# EAGLE schematic smartcar_shield_cutouts (EAGLE 9.4.0)
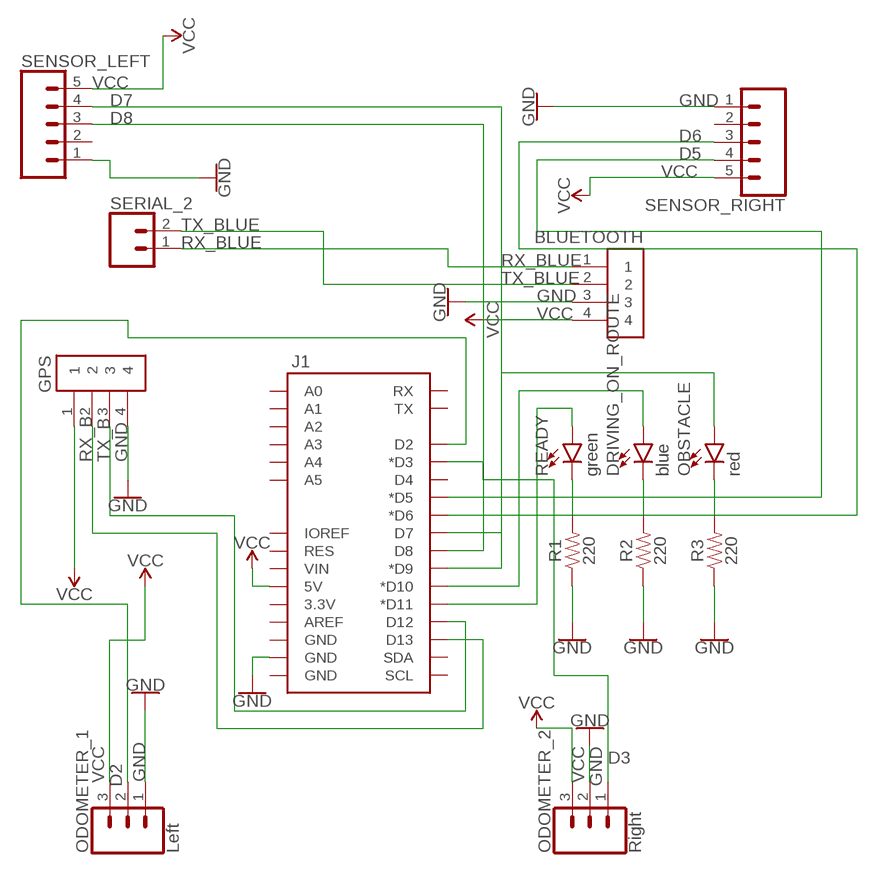
[diagram p0: schematic, sheet 1]

## Parts
BLUETOOTH  1X4-BIG  [1X04-BIG]
DRIVING_ON_ROUTE  blue  LED5MM  [LED_5MM]
GPS  1X4-BIG  [1X04-BIG]
J1  ARDUINO_R3_SHIELDUNO_R3_SHIELD_LOCK  [UNO_R3_SHIELD_LOCK]
OBSTACLE  red  LED5MM  [LED_5MM]
ODOMETER_1  Left  CONN_03  [1X03]
ODOMETER_2  Right  CONN_03  [1X03]
R1  220  220OHM-0603-1/10W-1%  [0603]
R2  220  220OHM-0603-1/10W-1%  [0603]
R3  220  220OHM-0603-1/10W-1%  [0603]
READY  green  LED5MM  [LED_5MM]
SENSOR_LEFT  CONN_05  [1X05]
SENSOR_RIGHT  CONN_05  [1X05]
SERIAL_2  CONN_02  [1X02]

## Nets
D2: J1.D2 ODOMETER_1.2
D3: J1.D3(*D3) ODOMETER_2.1
D5: J1.D5(*D5) SENSOR_RIGHT.4
D6: J1.D6(*D6) SENSOR_RIGHT.3
D7: J1.D7 SENSOR_LEFT.4
D8: J1.D8 SENSOR_LEFT.3
GND: BLUETOOTH.3 GPS.4 J1.GND@1(GND) ODOMETER_1.1 ODOMETER_2.2 R1.1 R2.1 R3.1 SENSOR_LEFT.1 SENSOR_RIGHT.1
N$2: R1.2 READY.K(C)
N$9: DRIVING_ON_ROUTE.K(C) R2.2
N$11: OBSTACLE.K(C) R3.2
N$12: J1.D11(*D11) READY.A
N$13: DRIVING_ON_ROUTE.A J1.D10(*D10)
N$14: J1.D9(*D9) OBSTACLE.A
RX_B: GPS.2 J1.D13
RX_BLUE: BLUETOOTH.1 SERIAL_2.1
TX_B: GPS.3 J1.D12
TX_BLUE: BLUETOOTH.2 SERIAL_2.2
VCC: BLUETOOTH.4 GPS.1 J1.5V ODOMETER_1.3 ODOMETER_2.3 SENSOR_LEFT.5 SENSOR_RIGHT.5
Unconnected: J1.3.3V J1.A0 J1.A1 J1.A2 J1.A3 J1.A4 J1.A5 J1.AREF J1.D4 J1.GND@0(GND) J1.GND@2(GND) J1.IOREF J1.RES J1.RX J1.SCL J1.SDA J1.TX J1.VIN SENSOR_LEFT.2 SENSOR_RIGHT.2

## Library data of the parts
BLUETOOTH GPS = adafruit:1X4: 4-pin connector
DRIVING_ON_ROUTE OBSTACLE READY = SparkFun-LED:LED: LED (Generic) Standard schematic elements and footprints for 5mm, 3mm, 1206, and 0603 sized LEDs. Generic LEDs with no color specified.
J1 = SparkFun-Boards:ARDUINO_R3_SHIELD: Shield form compatible with the Arduino Uno R3.
ODOMETER_1 ODOMETER_2 = SparkFun-Connectors:CONN_03: Multi connection point. Often used as Generic Header-pin footprint for 0.1 inch spaced/style header connections On any of the 0.1 inch spaced packages, you can populate with these: Break Away Headers - Straight <https://www.sparkfun.com/products/116> (PRT-00116) Break Away Male Headers - Right Angle <https://www.sparkfun.com/products/553> (PRT-00553) Female Headers <https://www.sparkfun.com/products/115> (PRT-00115) Break Away Headers - Machine Pin <https://www.sparkfun.com/products/117> (PRT-00117) Break Away Female Headers - Swiss Machine Pin <https://www.sparkfun.com/products/743> (PRT-00743) Stackable Header - 3 Pin (Female, 0.1") <https://www.sparkfun.com/products/13875> (PRT-13875) For SCREWTERMINALS and SPRING TERMINALS visit here: Screw Terimnals on SparkFun.com <https://www.sparkfun.com/search/results?term=Screw+Terminals> (5mm/3.5mm/2.54mm spacing) This device is also useful as a general connection point to wire up your design to another part of your project. Our various solder wires solder well into these plated through hole pads. Hook-Up Wire - Assortment (Stranded, 22 AWG) <https://www.sparkfun.com/products/11375> (PRT-11375) Hook-Up Wire - Assortment (Solid Core, 22 AWG) <https://www.sparkfun.com/products/11367> (PRT-11367) View the entire wire category on our website here <https://www.sparkfun.com/categories/141> Special notes: Molex polarized connector foot print use with SKU : PRT-08232 with associated crimp pins and housings.; PROD_ID: XXX-00000; VALUE: 455-1750-1-ND
R1-R3 = SparkFun-Resistors:220OHM: 220Ω resistor A resistor is a passive two-terminal electrical component that implements electrical resistance as a circuit element. Resistors act to reduce current flow, and, at the same time, act to lower voltage levels within circuits. - Wikipedia; PROD_ID: RES-07861
SENSOR_LEFT SENSOR_RIGHT = SparkFun-Connectors:CONN_05: Multi connection point. Often used as Generic Header-pin footprint for 0.1 inch spaced/style header connections On any of the 0.1 inch spaced packages, you can populate with these: Break Away Headers - Straight <https://www.sparkfun.com/products/116> (PRT-00116) Break Away Male Headers - Right Angle <https://www.sparkfun.com/products/553> (PRT-00553) Female Headers <https://www.sparkfun.com/products/115> (PRT-00115) Break Away Headers - Machine Pin <https://www.sparkfun.com/products/117> (PRT-00117) Break Away Female Headers - Swiss Machine Pin <https://www.sparkfun.com/products/743> (PRT-00743) For SCREWTERMINALS and SPRING TERMINALS visit here: Screw Terimnals on SparkFun.com <https://www.sparkfun.com/search/results?term=Screw+Terminals> (5mm/3.5mm/2.54mm spacing) This device is also useful as a general connection point to wire up your design to another part of your project. Our various solder wires solder well into these plated through hole pads. Hook-Up Wire - Assortment (Stranded, 22 AWG) <https://www.sparkfun.com/products/11375> (PRT-11375) Hook-Up Wire - Assortment (Solid Core, 22 AWG) <https://www.sparkfun.com/products/11367> (PRT-11367) View the entire wire category on our website here <https://www.sparkfun.com/categories/141> Special notes: Molex polarized connector foot print use with SKU : PRT-08231 with associated crimp pins and housings. 1MM SMD Version SKU: PRT-10208
SERIAL_2 = SparkFun-Connectors:CONN_02: Multi connection point. Often used as Generic Header-pin footprint for 0.1 inch spaced/style header connections On any of the 0.1 inch spaced packages, you can populate with these: Break Away Headers - Straight <https://www.sparkfun.com/products/116> (PRT-00116) Break Away Male Headers - Right Angle <https://www.sparkfun.com/products/553> (PRT-00553) Female Headers <https://www.sparkfun.com/products/115> (PRT-00115) Break Away Headers - Machine Pin <https://www.sparkfun.com/products/117> (PRT-00117) Break Away Female Headers - Swiss Machine Pin <https://www.sparkfun.com/products/743> (PRT-00743) For SCREWTERMINALS and SPRING TERMINALS visit here: Screw Terimnals on SparkFun.com <https://www.sparkfun.com/search/results?term=Screw+Terminals> (5mm/3.5mm/2.54mm spacing) This device is also useful as a general connection point to wire up your design to another part of your project. Our various solder wires solder well into these plated through hole pads. Hook-Up Wire - Assortment (Stranded, 22 AWG) <https://www.sparkfun.com/products/11375> (PRT-11375) Hook-Up Wire - Assortment (Solid Core, 22 AWG) <https://www.sparkfun.com/products/11367> (PRT-11367) View the entire wire category on our website here <https://www.sparkfun.com/categories/141> Special notes: Molex polarized connector foot print use with: PRT-08233 with associated crimp pins and housings. 2.54_SCREWTERM for use with PRT-10571. 3.5mm Screw Terminal footprints for PRT-08084 5mm Screw Terminal footprints for use with PRT-08432

## Net classes
0 default: width 0.152 mm, drill 0.305 mm, clearance 0.152 mm